# EasyEDA Pro project SD CARD EASYEDA .epro

# Schematic sd card adapter kicad
Board Name: sd card adapter kicad; Create Date: 2026-05-26; Page Name: sd card adapter kicad; Project Name: sd card adapter kicad; Schematic Name: sd card adapter kicad; Update Date: 2026-05-26; File: sd card adapter kicad; Id: /; Sheet: /
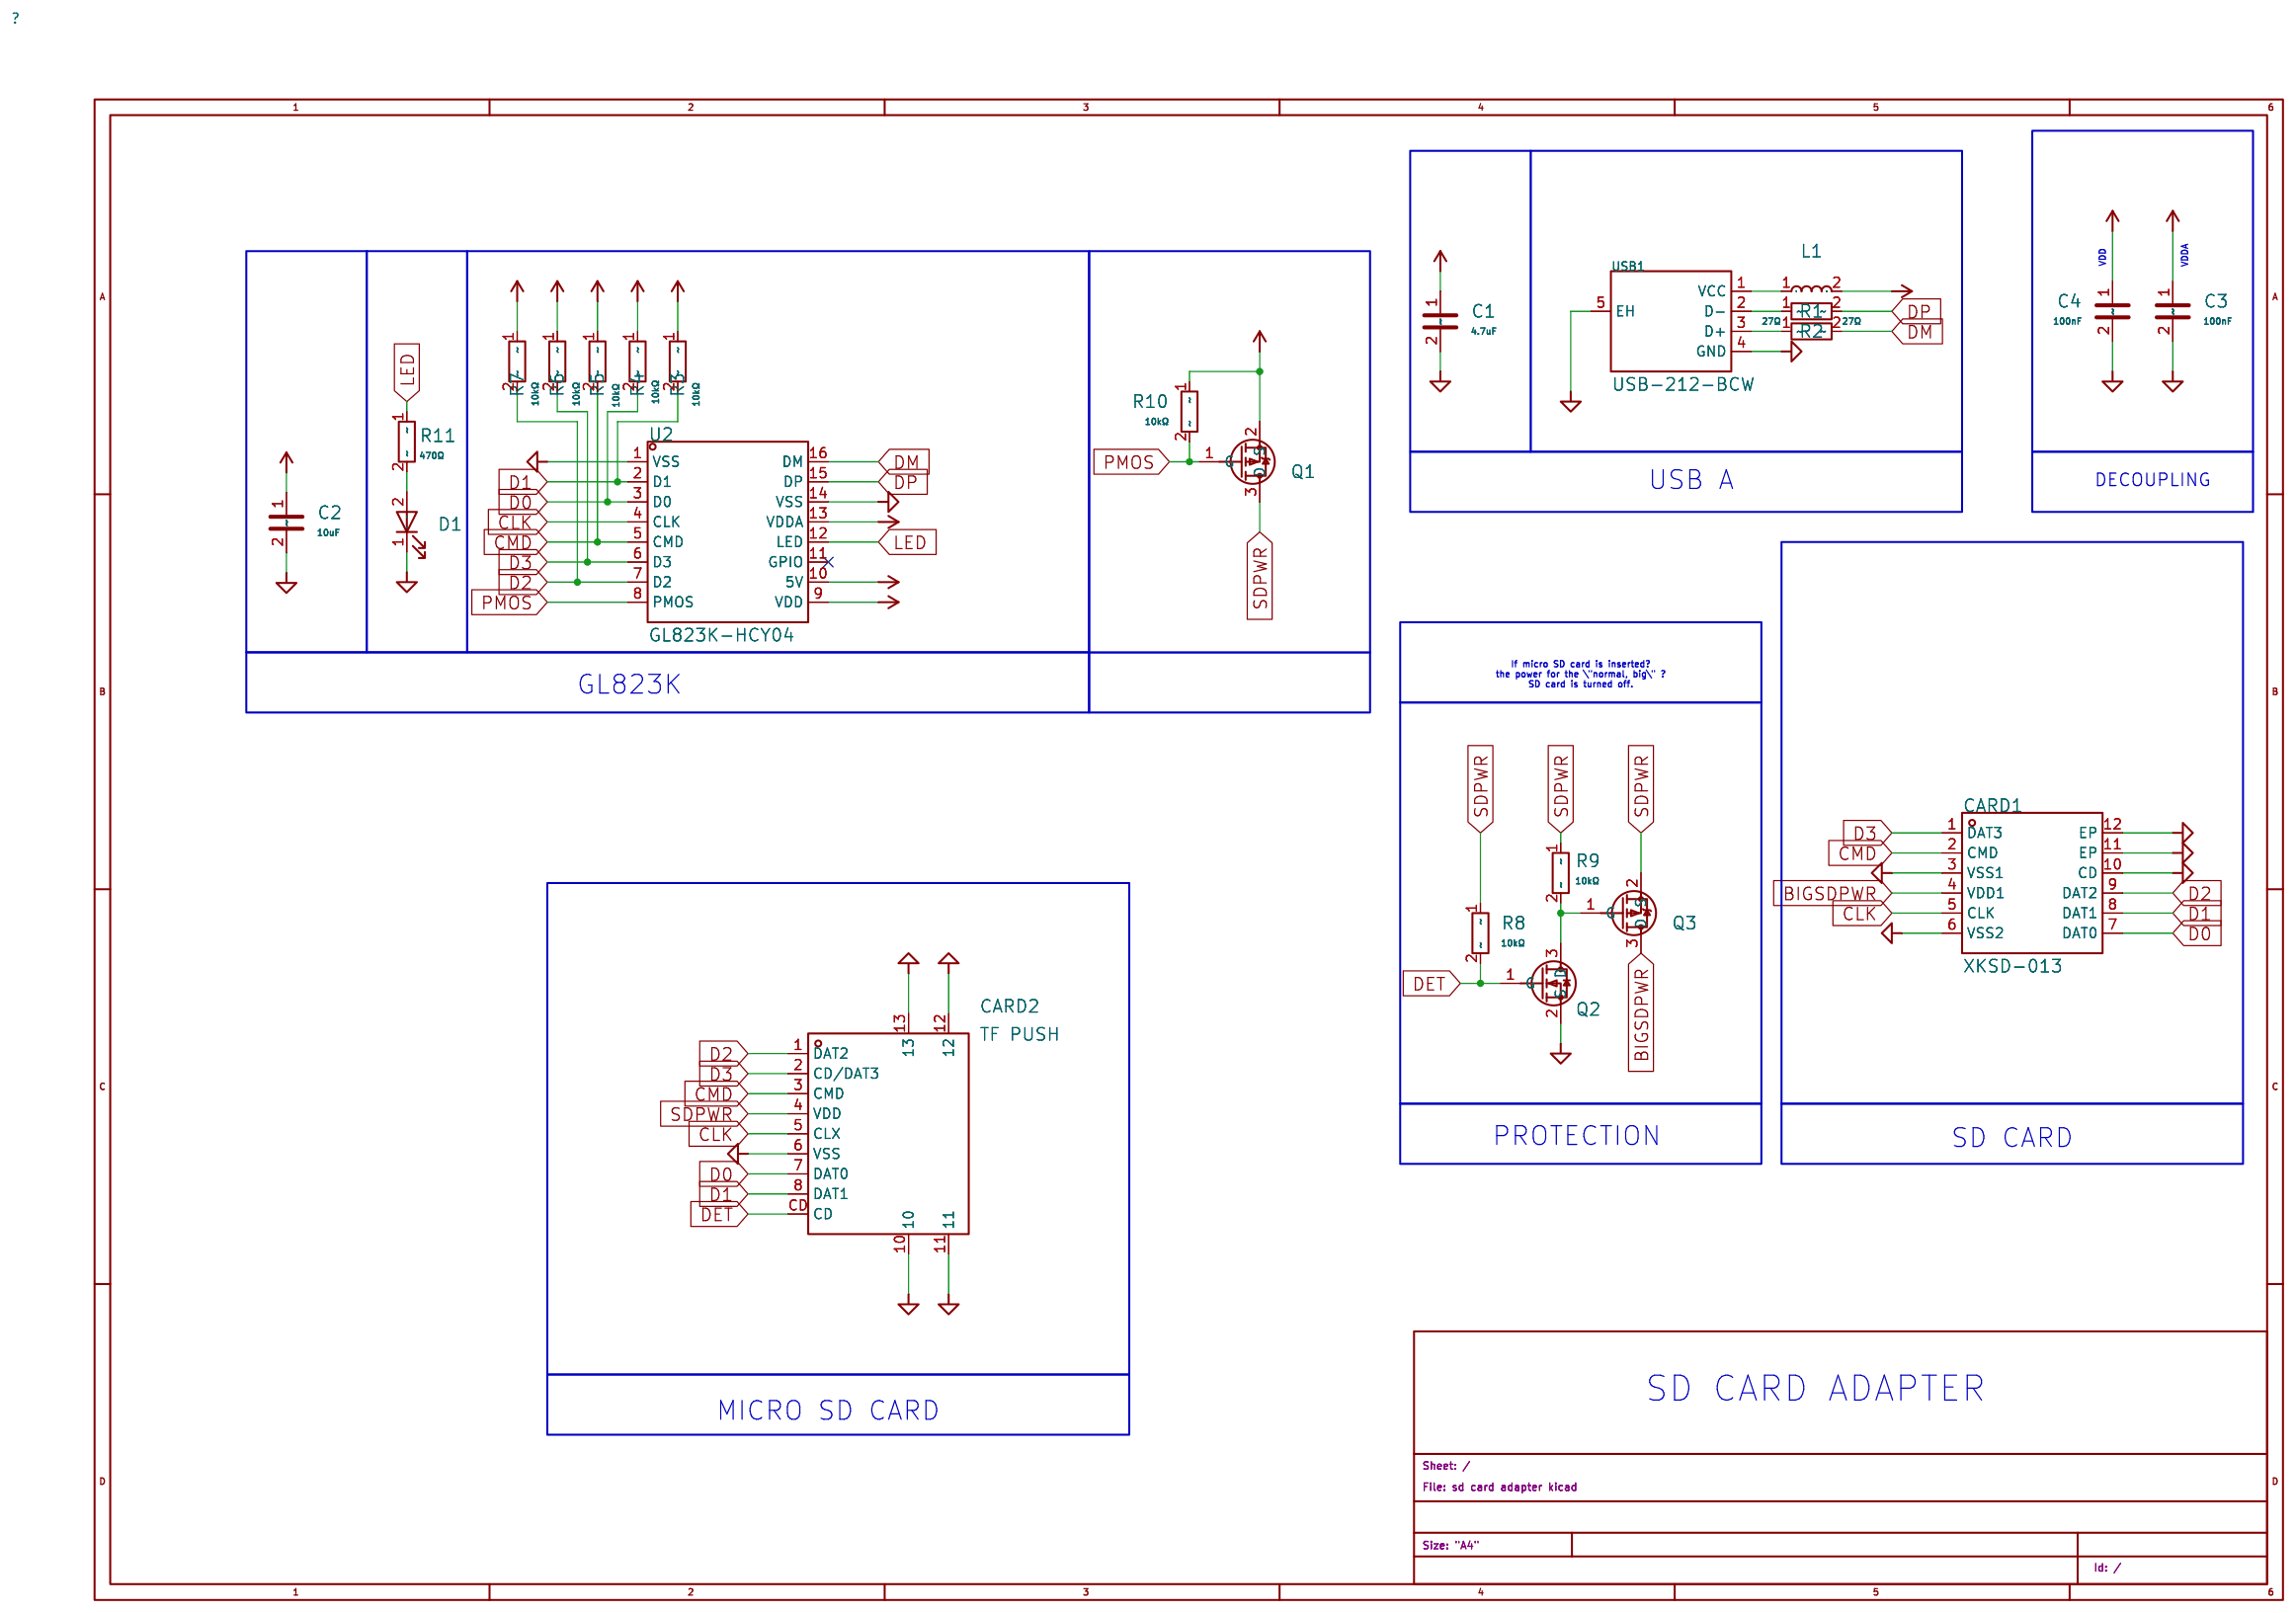
[diagram p0: schematic sheet]

## Parts
C1  4.7uF  [Capacitor_SMD:C_0603_1608Metric]
C2  10uF  [Capacitor_SMD:C_0603_1608Metric]
C3  100nF  [Capacitor_SMD:C_0603_1608Metric]
C4  100nF  [Capacitor_SMD:C_0603_1608Metric]
CARD1  XKSD-013  [SIM-SMD_XKSD-013]
CARD2  TF PUSH  [TF-SMD_TF-PUSH]
D1  YLED0603B  [LED_SMD:LED_0603_1608Metric]
L1  MPZ2012S601AT000  [Inductor_SMD:L_0805_2012Metric]
Q1  AO3401A  [Package_TO_SOT_SMD:SOT-23]
Q2  2N7002  [Package_TO_SOT_SMD:SOT-23]
Q3  AO3401A  [Package_TO_SOT_SMD:SOT-23]
R1  27Ω  [Resistor_SMD:R_0603_1608Metric]
R2  27Ω  [Resistor_SMD:R_0603_1608Metric]
R3  10kΩ  [Resistor_SMD:R_0603_1608Metric]
R4  10kΩ  [Resistor_SMD:R_0603_1608Metric]
R5  10kΩ  [Resistor_SMD:R_0603_1608Metric]
R6  10kΩ  [Resistor_SMD:R_0603_1608Metric]
R7  10kΩ  [Resistor_SMD:R_0603_1608Metric]
R8  10kΩ  [Resistor_SMD:R_0603_1608Metric]
R9  10kΩ  [Resistor_SMD:R_0603_1608Metric]
R10  10kΩ  [Resistor_SMD:R_0603_1608Metric]
R11  470Ω  [Resistor_SMD:R_0603_1608Metric]
U2  GL823K-HCY04  [SSOP-16_L4.9-W3.9-P0.64-LS6.0-BL]
USB1  USB-212-BCW  [USB-A-SMD_USB-212-BCW]

## Library data of the parts
C1 = CL10A475KO8NNNC: Capacitance:4.7uF Tolerance:±10% Tolerance:±10% Voltage Rating:16V Temperature Coefficient:X5R; LCSC Part Name: 4.7uF ±10% 16V; Supplier Part: C19666; Manufacturer: SAMSUNG(三星); Supplier Footprint: 0603; JLCPCB Part Class: Basic Part; Datasheet: https://item.szlcsc.com/datasheet/CL10A475KO8NNNC/20375.html; Supplier: LCSC; Tolerance: ±10%; Voltage Rating: 16V; Temperature Coefficient: X5R
C2 = CL10A106KP8NNNC: Capacitance:10uF Tolerance:±10% Tolerance:±10% Voltage Rating:10V Temperature Coefficient:X5R; LCSC Part Name: 10uF ±10% 10V; Supplier Part: C19702; Manufacturer: SAMSUNG(三星); Supplier Footprint: 0603; JLCPCB Part Class: Basic Part; Datasheet: https://item.szlcsc.com/datasheet/CL10A106KP8NNNC/20411.html; Supplier: LCSC; Tolerance: ±10%; Voltage Rating: 10V; Temperature Coefficient: X5R
C3 C4 = CL10B104KO8NNNC: Capacitance:100nF Tolerance:±10% Tolerance:±10% Voltage Rating:16V Temperature Coefficient:X7R; LCSC Part Name: 100nF ±10% 16V; Supplier Part: C66501; Manufacturer: SAMSUNG(三星); Supplier Footprint: 0603; JLCPCB Part Class: Extended Part; Datasheet: https://item.szlcsc.com/datasheet/CL10B104KO8NNNC/67585.html; Supplier: LCSC; Tolerance: ±10%; Voltage Rating: 16V; Temperature Coefficient: X7R
CARD1 = XKSD-013: Card Connection Mode:Push-Pull Card Type:Standard SD Card Connector Type:Connector and Ejector Additional Card Detection Pins:- Supplementary Features:- Height Above Board:3.5mm Operating Temperature:-20℃~+60℃ Operating Temperature:-20℃~+60℃; LCSC Part Name: 拔插式 标准SD卡 卡座; Supplier Part: C2764609; Manufacturer: XKB Connection(中国星坤); Supplier Footprint: SMD; Datasheet: https://item.szlcsc.com/datasheet/XKSD-013/2898466.html; Supplier: LCSC; Card Connection Mode: Push-Pull; Card Type: Standard SD Card; Connector Type: Connector and Ejector; Height Above Board: 3.5mm; Operating Temperature: -20℃~+60℃
CARD2 = TF PUSH: Card Connection Mode:Push-Push Card Type:MicroSD Card (TF Card) Connector Type:Connector and Ejector Additional Card Detection Pins:No Supplementary Features:- Height Above Board:2mm Operating Temperature:-25℃~+90℃ Operating Temperature:-25℃~+90℃; LCSC Part Name: 9P，自弹式TF卡座; Supplier Part: C393941; Manufacturer: SHOU HAN(首韩); Supplier Footprint: SMD; JLCPCB Part Class: Extended Part; Datasheet: https://item.szlcsc.com/datasheet/TF%2520PUSH/372553.html; Supplier: LCSC; Card Connection Mode: Push-Push; Card Type: MicroSD Card (TF Card); Connector Type: Connector and Ejector; Additional Card Detection Pins: No; Height Above Board: 2mm; Operating Temperature: -25℃~+90℃
D1 = YLED0603B: Lamp Holder Type:- Illumination Color:Blue Voltage - Forward(Vf):2.6V~3.2V Voltage - Forward(Vf):2.6V~3.2V Power(Watts):- Forward Current:30mA Wavelength - Dominant:460nm~475nm Wavelength - Dominant:460nm~475nm Peak Wavelength:- Diode Configuration:Discre; LCSC Part Name: 蓝色 独立二极管; Supplier Part: C19171394; Manufacturer: YONGYUTAI(永裕泰); Supplier Footprint: 0603; JLCPCB Part Class: Extended Part; Datasheet: https://item.szlcsc.com/datasheet/YLED0603B/20382445.html; Supplier: LCSC; Illumination Color: Blue; Voltage - Forward(Vf): 2.6V~3.2V; Forward Current: 30mA; Wavelength - Dominant: 460nm~475nm; Diode Configuration: Discrete Diode; Luminous Intensity: 42mcd~86mcd; Viewing Angle: 120°; Operating Temperature: -40℃~+85℃
L1 = MPZ2012S601AT000: Impedance @ Frequency:600Ω@100MHz Tolerance:±25% Tolerance:±25% DC Resistance(DCR):100mΩ Current Rating:2A Number of Circuits:1 Operating Temperature:-55℃~+125℃ Operating Temperature:-55℃~+125℃; LCSC Part Name: 单路 0805磁珠 阻抗600Ω@100MHz; Supplier Part: C21519; Manufacturer: TDK; Supplier Footprint: 0805; JLCPCB Part Class: Extended Part; Datasheet: https://item.szlcsc.com/datasheet/MPZ2012S601AT000/22238.html; Supplier: LCSC; Impedance @ Frequency: 600Ω@100MHz; Tolerance: ±25%; DC Resistance(DCR): 100mΩ; Current Rating: 2A; Number of Circuits: 1; Operating Temperature: -55℃~+125℃
Q1 Q3 = AO3401A_C48678024: Number:1 P-Channel Drain to Source Voltage:30V Current - Continuous Drain(Id):4.2A RDS(on):50mΩ@10V Pd - Power Dissipation:1.4W Gate Threshold Voltage (Vgs(th)):1.3V Gate Charge(Qg):9.4nC@4.5V Input Capacitance(Ciss):954pF Reverse Transfer Capacitance (Cr; LCSC Part Name: P沟道增强型MOSFET; Supplier Part: C48678024; Manufacturer: baocheng(宝乘); Supplier Footprint: SOT-23; JLCPCB Part Class: Extended Part; Datasheet: https://item.szlcsc.com/datasheet/AO3401A/50959452.html; Supplier: LCSC; Number: 1 P-Channel; Drain to Source Voltage: 30V; Current - Continuous Drain(Id): 4.2A; RDS(on): 50mΩ@10V; Pd - Power Dissipation: 1.4W; Gate Threshold Voltage (Vgs(th)): 1.3V; Gate Charge(Qg): 9.4nC@4.5V; Input Capacitance(Ciss): 954pF; Reverse Transfer Capacitance (Crss@Vds): 77pF; Type: P-Channel; Output Capacitance(Coss): 115pF
Q2 = 2N7002_C916396: Number:1 N-channel Drain to Source Voltage:60V Current - Continuous Drain(Id):115mA RDS(on):1.7Ω@5V Pd - Power Dissipation:200mW Gate Threshold Voltage (Vgs(th)):2.5V Gate Charge(Qg):- Input Capacitance(Ciss):50pF Reverse Transfer Capacitance (Crss@Vds):5; LCSC Part Name: 1个N沟道 耐压:60V 电流:115mA; Supplier Part: C916396; Manufacturer: JSMSEMI(杰盛微); Supplier Footprint: SOT-23; JLCPCB Part Class: Extended Part; Datasheet: https://item.szlcsc.com/datasheet/2N7002/990892.html; Supplier: LCSC; Number: 1 N-channel; Drain to Source Voltage: 60V; Current - Continuous Drain(Id): 115mA; RDS(on): 1.7Ω@5V; Pd - Power Dissipation: 200mW; Gate Threshold Voltage (Vgs(th)): 2.5V; Input Capacitance(Ciss): 50pF; Reverse Transfer Capacitance (Crss@Vds): 5pF; Operating Temperature: -55℃~+150℃
R1 R2 = RC0603FR-0727RL: Type:Thick Film Resistors Resistance: Tolerance:±1% Tolerance:±1% Power(Watts): Overload Voltage (Max): Temperature Coefficient:±100ppm/℃ Temperature Coefficient:±100ppm/℃ Operating Temperature Range:-55℃~+155℃ Operating Temperature Range:-55℃~+155℃; LCSC Part Name: 厚膜电阻 27Ω ±1% 100mW; Supplier Part: C137753; Manufacturer: YAGEO(国巨); Supplier Footprint: 0603; JLCPCB Part Class: Extended Part; Datasheet: https://atta.szlcsc.com/upload/public/pdf/source/20180821/C275644_0D56F95EFF785E7D9A1FEF436B37DA78.pdf; Supplier: LCSC; Type: Thick Film Resistors; Tolerance: ±1%; Temperature Coefficient: ±100ppm/℃; Operating Temperature Range: -55℃~+155℃
R3-R10 = FRC0603J103 TS: Type:Thick Film Resistor Resistance:10kΩ Tolerance:±5% Tolerance:±5% Power(Watts):100mW Voltage-Supply(Max):75V Temperature Coefficient:±100ppm/℃ Temperature Coefficient:±100ppm/℃ Operating Temperature:-55℃~+155℃ Operating Temperature:-55℃~+155℃; LCSC Part Name: 10kΩ ±5% 100mW 厚膜电阻; Supplier Part: C2930027; Manufacturer: FOJAN(富捷); Supplier Footprint: 0603; JLCPCB Part Class: Extended Part; Datasheet: https://item.szlcsc.com/datasheet/FRC0603J103%2520TS/3266960.html; Supplier: LCSC; Type: Thick Film Resistor; Tolerance: ±5%; Power(Watts): 100mW; Voltage-Supply(Max): 75V; Temperature Coefficient: ±100ppm/℃; Operating Temperature: -55℃~+155℃
R11 = FRC0603J471 TS: Type:Thick Film Resistor Resistance:470Ω Tolerance:±5% Tolerance:±5% Power(Watts):100mW Voltage-Supply(Max):75V Temperature Coefficient:±100ppm/℃ Temperature Coefficient:±100ppm/℃ Operating Temperature:-55℃~+155℃ Operating Temperature:-55℃~+155℃; LCSC Part Name: 470Ω ±5% 100mW 厚膜电阻; Supplier Part: C2907172; Manufacturer: FOJAN(富捷); Supplier Footprint: 0603; JLCPCB Part Class: Extended Part; Supplier: LCSC; Type: Thick Film Resistor; Tolerance: ±5%; Power(Watts): 100mW; Voltage-Supply(Max): 75V; Temperature Coefficient: ±100ppm/℃; Operating Temperature: -55℃~+155℃
U2 = GL823K-HCY04: Applications Function:USB to SD USB Protocol:USB 2.0 Voltage - Supply:4.75V~5.25V Voltage - Supply:4.75V~5.25V Data Rate:480Mbps Operating Temperature:0℃~+70℃ Operating Temperature:0℃~+70℃ Current - Supply:50mA Quiescent Supply Current:300uA Features:FIFO; LCSC Part Name: USB 2.0 SD/MSPRO 卡读取控制器; Supplier Part: C284879; Manufacturer: GENESYS(创惟); Supplier Footprint: SSOP-16-150mil; JLCPCB Part Class: Extended Part; Datasheet: https://item.szlcsc.com/datasheet/GL823K-HCY04/270382.html; Supplier: LCSC; Applications Function: USB to SD; USB Protocol: USB 2.0; Voltage - Supply: 4.75V~5.25V; Data Rate: 480Mbps; Operating Temperature: 0℃~+70℃; Current - Supply: 50mA; Quiescent Supply Current: 300uA; Features: FIFO buffer；Built-in clock generator；Power-on reset
USB1 = USB-212-BCW: Connector Type:Type-A Protocol Standard:USB 2.0 Gender:Male Mounting Type:Surface Mount, Right Angle Number of Contacts:4P Number of Ports:1 Current Rating-Power:1.5A Voltage Rating:30V Connect-Disconnect Life:5,000 Cycles Length:18.8mm Detection color:Bl; LCSC Part Name: Type-A 公 卧贴; Supplier Part: C720521; Manufacturer: XUNPU(讯普); Supplier Footprint: SMD; JLCPCB Part Class: Extended Part; Datasheet: https://item.szlcsc.com/datasheet/USB-212-BCW/763528.html; Supplier: LCSC; Connector Type: Type-A; Protocol Standard: USB 2.0; Gender: Male; Mounting Type: Surface Mount, Right Angle; Number of Contacts: 4P; Number of Ports: 1; Current Rating-Power: 1.5A; Voltage Rating: 30V; Connect-Disconnect Life: 5,000 Cycles; Length: 18.8mm; Detection color: Black; Operating Temperature: -20℃~+70℃

## Nets
BIGSDPWR: CARD1.4(VDD1) Q3.3(D)
CLK: CARD1.5(CLK) CARD2.5(CLX) U2.4(CLK)
CMD: CARD1.2(CMD) CARD2.3(CMD) R5.2 U2.5(CMD)
D0: CARD1.7(DAT0) CARD2.7(DAT0) R4.2 U2.3(D0)
D1: CARD1.8(DAT1) CARD2.8(DAT1) R3.2 U2.2(D1)
D2: CARD1.9(DAT2) CARD2.1(DAT2) R7.2 U2.7(D2)
D3: CARD1.1(DAT3) CARD2.2(CD/DAT3) R6.2 U2.6(D3)
DET: CARD2.CD Q2.1(G) R8.2
DM: R2.2 U2.16(DM)
DP: R1.2 U2.15(DP)
LED: R11.1 U2.12(LED)
PMOS: Q1.1(G) R10.2 U2.8(PMOS)
POWER_+3.3V: C2.1 C3.1 C4.1 Q1.2(S) R3.1 R4.1 R5.1 R6.1 R7.1 R10.1 U2.9(VDD) U2.13(VDDA)
POWER_+5V: C1.1 L1.2 U2.10(5V)
POWER_GND: C1.2 C3.2 C4.2 CARD1.3(VSS1) CARD1.6(VSS2) CARD1.10(CD) CARD1.11(EP) CARD1.12(EP) CARD2.6(VSS) CARD2.10 CARD2.11 CARD2.12 CARD2.13 D1.1(K) Q2.2(S) U2.1(VSS) U2.14(VSS) USB1.4(GND) USB1.5(EH)
SDPWR: CARD2.4(VDD) Q1.3(D) Q3.2(S) R8.1 R9.1
$1N28: L1.1 USB1.1(VCC)
$1N35: R1.1 USB1.2(D-)
$1N48: Q2.3(D) Q3.1(G) R9.2
$1N52: D1.2(A) R11.2
$1N66: R2.1 USB1.3(D+)

Not connected (* = marked no-connect by the designer): C2 2; U2 11(GPIO)*

## Notes on the sheet
- VDD
- VDDA
- USB A
- DECOUPLING
- If micro SD card is inserted
  the power for the \"normal, big\"
  SD card is turned off.
- GL823K
- PROTECTION
- SD CARD
- SD CARD ADAPTER
- MICRO SD CARD

# Board sd card adapter kicad
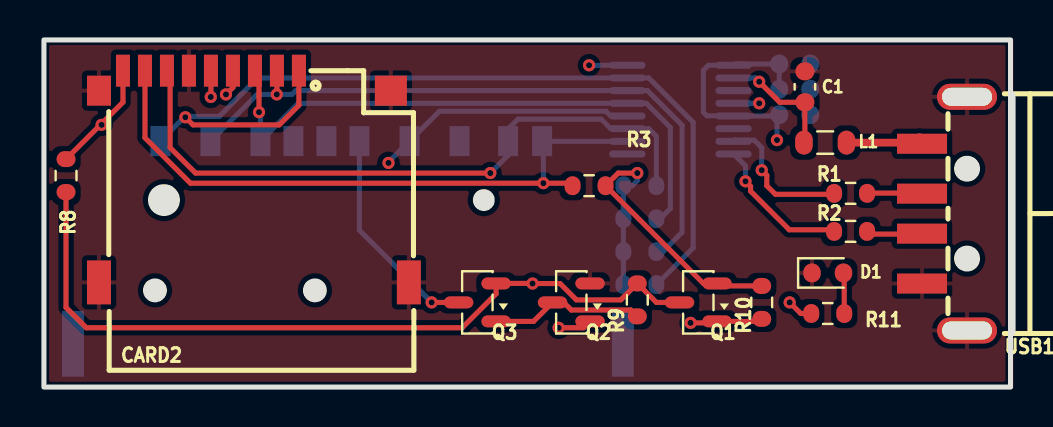
[diagram p1: board, top side]
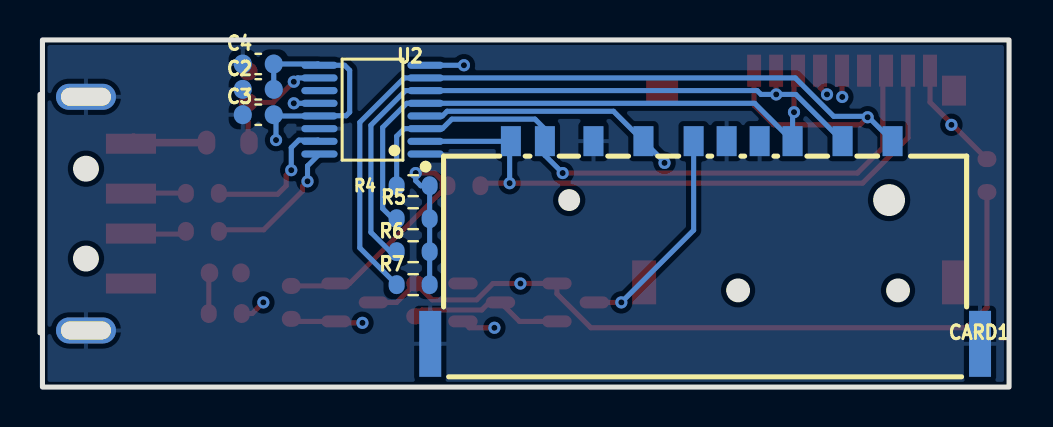
[diagram p2: board, bottom side, seen from below]

Outline 48.47 x 17.38 mm; copper layers: Top Layer, Inner1, Inner2, Bottom Layer. Coordinates in mm from the lower left corner of the outline.
Outline path: rectangle 0,17.38 48.35,0
Stack: Top Layer 0.035mm Outer layer thickness 1oz / Dielectric1 0.2104mm 7628 RC49% 8.6mil / Inner1 0.0152mm Inner layer thickness / Dielectric2 1.065mm 1.1mm H/HOZ Copper / Inner2 0.0152mm Inner layer thickness / Dielectric3 0.2104mm 7628 RC49% 8.6mil / Bottom Layer 0.035mm Outer layer thickness 1oz

## Design rules (mm)
net DP: DP
net DM: DP
spacing safeClearance (default): track to track 0, other pairs 0 to 0.5
spacing Plane_innerPlane: track to track 0, other pairs 0 to 0.5
spacing Copper_copperRegion: track to track 0, other pairs 0 to 0.5
track width trackWidth (default): min 0.127, default 0.254, max 2.54
differential pair differentialPair (default): width min 0.127, default 0.254, max 2.54; gap min 0.152, default 0.152
pour e212 uses Copper_copperRegion
pour e220 uses Copper_copperRegion
pour e257 uses Copper_copperRegion
pour e265 uses Copper_copperRegion

## Placement (name value [footprint] x y rotation side)
C1  4.7uF  [Capacitor_SMD:C_0603_1608Metric]  38.06 15.03 90 top
C2  10uF  [Capacitor_SMD:C_0603_1608Metric]  37.55 14.91 0 bottom
C3  100nF  [Capacitor_SMD:C_0603_1608Metric]  37.55 13.64 0 bottom
C4  100nF  [Capacitor_SMD:C_0603_1608Metric]  37.55 16.18 0 bottom
CARD1  XKSD-013  [SIM-SMD_XKSD-013]  15.2 7.24 180 bottom
CARD2  TF PUSH  [TF-SMD_TF-PUSH]  10.5 10.54 0 top
D1  YLED0603B  [LED_SMD:LED_0603_1608Metric]  39.21 5.71 0 top
L1  MPZ2012S601AT000  [Inductor_SMD:L_0805_2012Metric]  39.08 12.24 180 top
Q1  AO3401A  [Package_TO_SOT_SMD:SOT-23]  32.73 4.24 180 top
Q2  2N7002  [Package_TO_SOT_SMD:SOT-23]  26.38 4.24 180 top
Q3  AO3401A  [Package_TO_SOT_SMD:SOT-23]  21.68 4.24 180 top
R1  27Ω  [Resistor_SMD:R_0603_1608Metric]  40.35 9.7 180 top
R2  27Ω  [Resistor_SMD:R_0603_1608Metric]  40.35 7.8 180 top
R3  10kΩ  [Resistor_SMD:R_0603_1608Metric]  27.27 10.08 180 top
R4  10kΩ  [Resistor_SMD:R_0603_1608Metric]  29.81 10.08 0 bottom
R5  10kΩ  [Resistor_SMD:R_0603_1608Metric]  29.81 8.43 0 bottom
R6  10kΩ  [Resistor_SMD:R_0603_1608Metric]  29.81 6.78 0 bottom
R7  10kΩ  [Resistor_SMD:R_0603_1608Metric]  29.81 5.13 0 bottom
R8  10kΩ  [Resistor_SMD:R_0603_1608Metric]  1.11 10.59 90 top
R9  10kΩ  [Resistor_SMD:R_0603_1608Metric]  29.68 4.37 270 top
R10  10kΩ  [Resistor_SMD:R_0603_1608Metric]  35.9 4.24 270 top
R11  470Ω  [Resistor_SMD:R_0603_1608Metric]  39.21 3.68 0 top
U2  GL823K-HCY04  [SSOP-16_L4.9-W3.9-P0.64-LS6.0-BL]  31.84 13.89 90 bottom
USB1  USB-212-BCW  [USB-A-SMD_USB-212-BCW]  45.05 8.68 90 top

## Footprints (pads in the part's own frame, mm; a bottom-side part is the same pattern mirrored in y, then rotated)
Capacitor_SMD:C_0603_1608Metric
  rrect 0.9x0.95 smd: 1(-0.775,0) 2(0.775,0)
Inductor_SMD:L_0805_2012Metric
  rrect 0.875x1.2 smd: 1(-1.062,0) 2(1.062,0)
LED_SMD:LED_0603_1608Metric
  rrect 0.875x0.95 smd: 1(-0.787,0) 2(0.787,0)
Package_TO_SOT_SMD:SOT-23
  rrect 1.475x0.6 smd: 1(-0.938,0.95) 2(-0.938,-0.95) 3(0.938,0)
Resistor_SMD:R_0603_1608Metric
  rrect 0.8x0.95 smd: 1(-0.825,0) 2(0.825,0)
SIM-SMD_XKSD-013
  rect 1x1.5 smd: 1(6.875,5.074) 2(4.375,5.074) 3(1.075,5.074) 4(-0.575,5.074) 5(-3.085,5.074) 6(-5.585,5.074) 7(-8.015,5.074) 8(-9.715,5.074) 9(9.375,5.074) 10(2.725,5.074)
  rect 1.1x3.3 smd: 11(-13.75,-5.074) 12(13.75,-5.074)
SSOP-16_L4.9-W3.9-P0.64-LS6.0-BL
  oval 0.355x1.815 smd: 1(-2.223,-2.655) 2(-1.587,-2.655) 3(-0.953,-2.655) 4(-0.318,-2.655) 5(0.318,-2.655) 6(0.953,-2.655) 7(1.587,-2.655) 8(2.223,-2.655) 9(2.223,2.655) 10(1.587,2.655) 11(0.953,2.655) 12(0.318,2.655) 13(-0.318,2.655) 14(-0.953,2.655) 15(-1.587,2.655) 16(-2.223,2.655)
TF-SMD_TF-PUSH
  rect 0.7x1.6 smd: 1(2.25,5.3) 2(1.15,5.3) 3(0.05,5.3) 4(-1.05,5.3) 5(-2.15,5.3) 6(-3.25,5.3) 7(-4.35,5.3) 8(-5.45,5.3) CD(-6.55,5.3)
  rect 1.2x1.5 smd: 10(-7.75,4.3)
  rect 1.2x2.2 smd: 11(-7.75,-5.3) 12(7.75,-5.3)
  rect 1.6x1.5 smd: 13(6.85,4.3)
USB-A-SMD_USB-212-BCW
  rect 1x2.5 smd: 1(3.5,1.125) 2(1,1.125) 3(-1,1.125) 4(-3.5,1.125)
  oval 1.3x3 hole 0.9x2.5: 5(-5.85,-1.125) 5(5.85,-1.125)

## Nets
As in the schematic, except:
POWER_GND: C1.2 C2.2 C3.2 C4.2 CARD1.3 CARD1.6 CARD1.10 CARD1.11 CARD1.12 CARD2.6 CARD2.10 CARD2.11 CARD2.12 CARD2.13 D1.1 Q2.2 U2.1 U2.14 USB1.4 USB1.5

Pads without a net: U2 11

## Via types
v1: diameter 0.61, hole 0.305, Top Layer to Bottom Layer, 21 vias

## Routing (per net, layer and track width the routed paths; a pad name or vN(x,y) marks a point on that pad's centre or on a via; arc(x,y) is an arc through that point)
BIGSDPWR: length 10.9
  Top Layer w0.254: v1(19.39,4.24) Q3.3
  Bottom Layer w0.254: v1(19.39,4.24) 15.78,7.85 CARD1.4
CLK: length 25.6
  Top Layer w0.254: v1(8.34,14.53) 8.35,14.54 CARD2.5
  Inner2 w0.254: v1(17.23,11.22) 14.19,11.22 10.12,15.29 8.6,15.29 8.34,15.03 v1(8.34,14.53)
  Bottom Layer w0.254: U2.4 28.35,13.57 28.11,13.81 19.79,13.81 CARD1.5 17.23,11.26 v1(17.23,11.22)
CMD: length 30.4
  Top Layer w0.254: v1(10.76,13.76) 10.76,15.26 10.55,15.47 CARD2.3
  Bottom Layer w0.254: R5.2 30.82,8.43 31.33,8.94 31.33,13 30.12,14.21 U2.5 12.72,14.21 CARD1.2 10.83,13.69 v1(10.76,13.76)
D0: length 33.5
  Top Layer w0.254: v1(22.33,10.72) 7.58,10.72 6.31,11.99 6.31,15.68 CARD2.7
  Bottom Layer w0.254: R4.2 30.63,12.56 30.25,12.94 U2.3 28.35,12.94 27.87,13.41 23.71,13.41 23.22,12.92 CARD1.7 23.22,11.6 v1(22.33,10.72)
D1: length 32.1
  Top Layer w0.254: R3.2 26.31,10.21 v1(24.98,10.21) 7.33,10.21 5.05,12.48 CARD2.8
  Bottom Layer w0.254: v1(24.98,10.21) 24.98,12.25 24.93,12.3 ; 24.93,12.3 CARD1.8 ; 24.93,12.3 U2.2
D2: length 45.8
  Top Layer w0.254: CARD2.1 12.75,14.11 11.77,13.13 7.45,13.13 v1(7.07,13.51)
  Bottom Layer w0.254: 7.07,13.56 7.07,13.51 v1(7.07,13.51) ; 7.07,13.56 CARD1.9 ; 7.07,13.56 8.77,13.56 10.69,15.48 U2.7 30.25,15.48 32.47,13.26 32.47,6.97 R7.2
D3: length 33.6
  Top Layer w0.254: v1(11.65,14.65) 11.65,14.66 CARD2.2
  Bottom Layer w0.254: CARD1.1 10.67,14.65 v1(11.65,14.65) 12.41,14.65 12.6,14.84 U2.6 30.19,14.84 31.92,13.11 31.92,7.75 30.95,6.78 R6.2
DET: length 34.4
  Top Layer w0.254: R8.2 3.95,14.26 CARD2.CD ; Q2.1 27,2.97 v1(25.74,2.97)
  Inner2 w0.254: v1(25.74,2.97) 18.38,2.97 9.23,12.11 3.9,12.11 v1(2.88,13.13)
DM: length 7.2
  Top Layer w0.254: v1(35.09,10.3) 35.34,10.05 35.34,9.81 37.28,7.87 39.4,7.87 39.52,8
  Bottom Layer w0.254: v1(35.09,10.3) 35.09,11.07 U2.16
DP: length 7.3
  Top Layer w0.254: v1(35.9,10.86) 36.16,10.61 36.16,10.08 36.59,9.65 39.27,9.65 39.52,9.91
  Bottom Layer w0.254: v1(35.9,10.86) 35.9,11.99 35.52,12.37 34.56,12.37 U2.15
LED: length 13.2
  Top Layer w0.254: 38.38,3.68 37.86,3.68 v1(37.3,4.24)
  Inner2 w0.254: v1(35.78,14.21) 37.3,12.68 v1(37.3,4.24)
  Bottom Layer w0.254: U2.12 v1(35.78,14.21)
PMOS: length 21.1
  Top Layer w0.254: 35.9,3.41 35.78,3.29 Q1.1 33.59,3.21 v1(32.34,3.21)
  Inner2 w0.254: v1(27.27,16.11) 26.63,15.48 26.63,8.93 v1(32.34,3.21)
  Bottom Layer w0.254: U2.8 v1(27.27,16.11)
POWER_+3.3V: length 38
  Top Layer w0.254: v1(29.68,10.72) 28.73,10.72 R3.1 32.98,5.19 Q1.2 33.79,5.06 R10.1
  Inner2 w0.254: v1(29.68,10.72) 35.01,10.72 v1(36.66,12.37)
  Bottom Layer w0.254: 36.72,13.57 C3.1 ; 36.72,13.57 U2.13 34.48,13.58 33.16,13.58 32.98,13.76 32.98,15.86 33.24,16.11 U2.9 34.56,16.18 C4.1 C2.1 ; 36.72,13.57 36.66,13.52 v1(36.66,12.37) ; R7.1 R6.1 R5.1 R4.1 29.43,10.08 29.68,10.33 v1(29.68,10.72)
POWER_+5V: length 5.9
  Top Layer w0.254: v1(35.78,15.29) 36.81,14.26 C1.1 38.06,12.49 38.02,12.45
  Bottom Layer w0.254: U2.10 35.59,15.48 v1(35.78,15.29)
SDPWR: length 61.1
  Top Layer w0.254: CARD2.4 9.45,15 v1(9.11,14.65) ; R8.1 1.11,3.98 2.12,2.97 20.92,2.97 22.62,4.67 Q3.2 24.44,5.19 v1(24.44,5.18) 25.81,5.18 26.63,4.37 28.85,4.37 R9.1 30.63,4.24 Q1.3
  Inner2 w0.254: v1(24.44,5.18) 24.44,5.92 23.2,7.16 15.07,7.16 9.17,13.07 9.17,14.59 v1(9.11,14.65)
$1N28: length 3.9
  Top Layer w0.381: 43.79,12.52 43.52,12.24 40.35,12.24 40.14,12.45
$1N35: length 3
  Top Layer w0.254: 41.17,9.91 41.17,9.78 41.24,9.71 43.67,9.71 43.79,9.83 43.79,10.02
$1N48: length 7.7
  Top Layer w0.254: Q3.1 24.49,3.29 Q2.3 26,4.24 26.38,3.86 29.36,3.86 R9.2
$1N52: length 2
  Top Layer w0.254: D1.2 40.03,5.68 R11.2
$1N66: length 3.2
  Top Layer w0.254: 41.17,8 41.17,7.75 41.26,7.66 43.72,7.66 43.79,7.73 43.79,8.02

## Copper pours and planes (outline as drawn; the poured copper is in the pictures)
POWER_GND on Top Layer: 0.13,17.38 48.35,17.38 48.35,0 0.13,0
POWER_GND on Bottom Layer: 0.13,17.38 48.35,17.38 48.35,0 0.13,0
POWER_GND on Inner1: 0.13,17.38 48.35,17.38 48.35,0 0.13,0
POWER_GND on Inner2: 0.13,17.38 48.35,17.38 48.35,0 0.13,0
